# Altium schematic sheet Keng Seng - 3rd Step Down Circuit.SchDoc
size A4; SheetNumber: 1; SheetTotal: 1
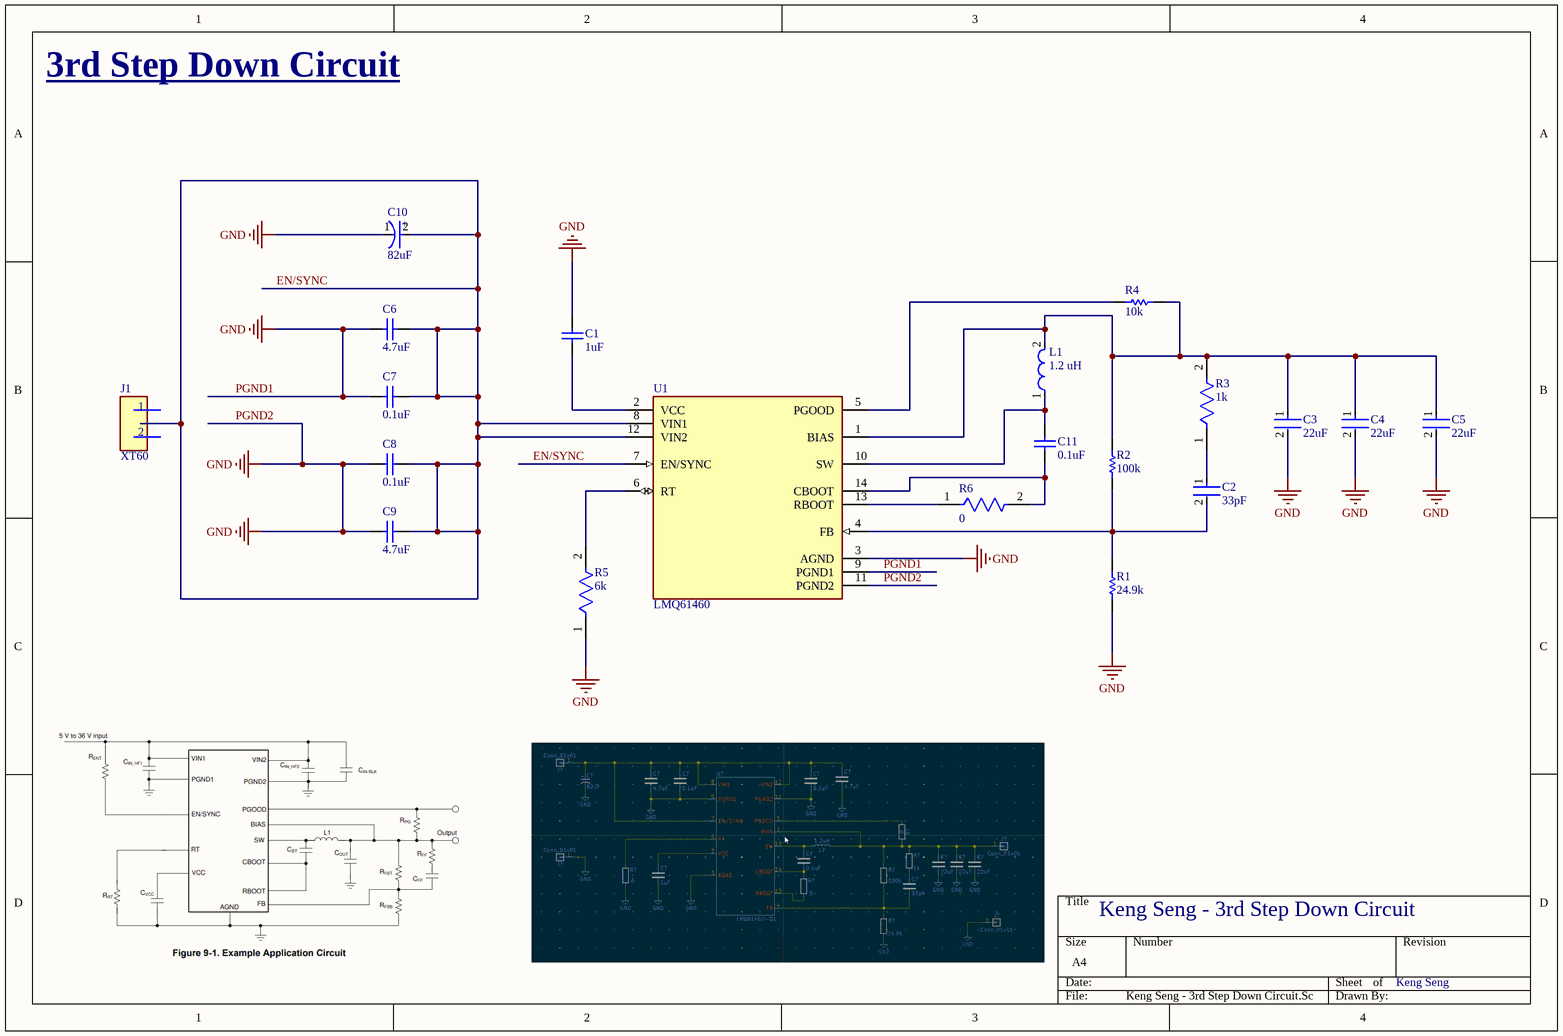
[diagram p0: Keng Seng - 3rd Step Down Circuit.SchDoc]

## Parts
C1  1uF  [CAPC2013X135X45LL10T25]
C2  33pF  [FP-CC0603-0_9-IPC_C]
C3  22uF  [FP-GRM21B-0_15-MFG]
C4  22uF  [FP-GRM21B-0_15-MFG]
C5  22uF  [FP-GRM21B-0_15-MFG]
C6  4.7uF  [CAPC2013X135X45LL10T25]
C7  0.1uF  [CAPC1005X55X30LL05T10]
C8  0.1uF  [CAPC1005X55X30LL05T10]
C9  4.7uF  [CAPC2013X135X45LL10T25]
C10  82uF  [FP-OS-CON-SMT-E12-MFG]
C11  0.1uF  [CAPC1005X55X30LL05T10]
J1  XT60  [FP-PRT-10474-MFG]
L1  1.2 uH  [FP-IHLP-5050FD-FP_2_945x4-MFG]
R1  24.9k  [RESC1609X55X30ML10T20]
R2  100k  [RESC0603X26X15LL03T05]
R3  1k  [FP-RC0402-0_4-IPC_A]
R4  10k  [RESC1609X50X30NL8T20]
R5  6k  [FP-RN732B-IPC_C]
R6  0  [FP-CRCW0402-e3-IPC_C]
U1  LMQ61460  [FP-RJR0014A-MFG]

## Nets
PGND1: C1.2 C3.2 C4.2 C5.2 C6.1 C7.1 C8.1 C9.1 C10.1(C) R1.1 R5.1 U1.3(AGND) U1.9(PGND1) U1.11(PGND2)  [also labelled GND, PGND2]
EN/SYNC: C6.2 C7.2 C8.2 C9.2 C10.2(A) U1.7(EN/SYNC) U1.8(VIN1) U1.12(VIN2)
NetC1_1: C1.1 U1.2(VCC)
NetC2_1: C2.1 R3.1
NetC2_2: C2.2 R1.2 R2.1 U1.4(FB)
NetC3_1: C3.1 C4.1 C5.1 L1.2 R2.2 R3.2 R4.2 U1.1(BIAS)
NetC11_1: C11.1 R6.2 U1.14(CBOOT)
NetC11_2: C11.2 L1.1 U1.10(SW)
NetR4_1: R4.1 U1.5(PGOOD)
NetR5_2: R5.2 U1.6(RT)
NetR6_1: R6.1 U1.13(RBOOT)

## Notes on the sheet
- 3rd Step Down Circuit
- Keng Seng - 3rd Step Down Circuit
- Keng Seng
- (in symbol CMP-05428-000027-2) +
- (in symbol CMP-157536-000001-1) 1; 2

## Library data of the parts
C1 = CMP-1036-04761-2: Manufacturer: Murata; Part Number: GRM21BR71H105KA12L
C2 = CMP-2000-06072-2: CAP CER 33PF 50V C0G/NPO 0603; Tolerance: 5%; Temperature Coefficient: 30ppm/°C; Dielectric: C0G; Insulation Resistance: 100GR; Dielectric Material: Ceramic; Voltage Rating (DC): 50V; Capacitance: 33pF; Voltage: 50V; Resistor Type: Ceramic; Lead Free: Lead Free; Mount: Surface Mount; Case Code (Imperial): 0603; Min Operating Temperature: -55°C; Package Quantity: 1; Case Code (Metric): 1608; Radiation Hardening: No; Packaging: Tape and Reel; Length: 1.6mm; Width: 0.031inch; Termination: SMD/SMT; Max Operating Temperature: 125°C; Series: CC; Case/Package: 0603; RoHS Compliant: Yes; Number of Pins: 2; REACH SVHC: No SVHC; Thickness: 0.035inch; Depth: 0.8mm; Voltage Rating: 50V; Height: 0.8mm
C3-C5 = CMP-2007-03385-2: Chip Multilayer Ceramic Capacitors for General Purpose, 0805, 22uF, X5R, 15%, 20%, 6.3V; Material: Ceramic; Max Operating Temperature: 85°C; Voltage: 6.3V; Min Operating Temperature: -55°C; Case/Package: 0805; Thickness: 0.053inch; Dielectric: X5R; Packaging: Tape and Reel; Depth: 1.25mm; Termination: SMD/SMT; Voltage Rating (DC): 6.3V; Radiation Hardening: No; Tolerance: 20%; Mount: Surface Mount; Lead Free: Lead Free; Package Quantity: 1; REACH SVHC: No SVHC; Voltage Rating: 6.3V; Capacitance: 22uF; Length: 2mm; Case Code (Imperial): 0805; Case Code (Metric): 2012; Width: 0.049inch; Height: 1.25mm
C6 C9 = CMP-1662-00015-2: Chip Capacitor, 4.7 uF, +/- 10%, 16 V, -55 to 85 degC, 0805 (2012 Metric), RoHS, Tape and Reel; PartNumber: GRM21BR61C475KA88L; Voltage Rating (DC): 16 V; Type (Capacitors): X5R; Case\/Package: 0805; Pins: 2; DatasheetVersion: 03/2016; REACH SVHC: No SVHC; Tolerance: 10%; Width: 1.25 mm; Capacitance: 4.7 uF; Mount: Surface Mount; ComponentLink1Description: Manufacturer URL; Case Code (Metric): 2012; PackageDescription: 2-Pin Surface Mount Device, Body 2 x 1.25 mm; Height: 1.25 mm; Voltage Rating: 16 V; Max Operating Temperature: 85 degC; RoHSCompliant: true; Length: 2 mm; ComponentLink1URL: http://www.murata.com/; Mounting Technology: Surface Mount; Packaging: Tape and Reel; Min Operating Temperature: -55 degC; ComponentLink2Description: Datasheet; Case Code (Imperial): 0805; Radiation Hardening: No; Package Quantity: 3000; PackageReference: 0805; ComponentLink2URL: http://search.murata.co.jp/Ceramy/image/img/A01X/G101/ENG/GRM21BR61C475KA88-01.pdf
C7 C8 C11 = CMP-0001-00074-2: Manufacturer: Kemet; Part Number: C0402C104K4RACTU
C10 = CMP-05428-000027-2: Conductive Polymer Aluminum Solid Capacitors (OS-CON) 82uF ±20% 35V; Ripple Current (AC): 4A; Dissipation Factor: 12%; ESR (Equivalent Series Resistance): 20mR; Polarity: Polar; Life (Hours): 5000Hour; Leakage Current: 574uA; Lead Free: Lead Free; Number of Pins: 12; Ripple Current: 4A; Capacitance: 82uF; Series: OS-CON™, SVPF; Height: 11.9mm; Min Operating Temperature: -55°C; Tolerance: 20%; Voltage Rating: 35V; Voltage Rating (DC): 35V; Case/Package: Radial; Diameter: 8mm; Voltage: 35V; Construction: Cylindrical; Packaging: Tape and Reel; Mount: Surface Mount; REACH SVHC: No SVHC; Height - Seated (Max): 0.472inch; Max Operating Temperature: 105°C; Package Quantity: 400; Termination: SMD/SMT; RoHS Compliant: Yes; Length: 11.9mm
J1 = CMP-157536-000001-1: XT60 CONNECTORS MALE/FEMALE PAIR
L1 = CMP-02424-000367-1: Commercial Inductors, High Saturation Series 1.2uH 30A 2.5mΩ 20%; Max DC Current: 48A; Shielding: Shielded; Test Frequency: 100kHz; DC Resistance (DCR): 2.5mR; Core Material: Metal; Self Resonant Frequency: 5MHz; Lead Free: Lead Free; Radiation Hardening: No; Case/Package: 5050; Termination: SMD/SMT; Package Quantity: 250; Packaging: Tape and Reel; Width: 0.508inch; Saturation Current: 48A; Number of Pins: 5050; Inductance Tolerance: 20%; Height - Seated (Max): 0.256inch; RMS Current (Irms): 30A; Tolerance: 20%; Military Standard: Not; Inductance: 1.2uH; Max Operating Temperature: 125°C; Min Operating Temperature: -55°C; Mount: Surface Mount; Depth: 12.9mm; Current Rating: 30A; Contact Plating: Tin; Length: 13.7mm; Height: 6.5mm
R1 = CMP-2000-03742-1: Part Number: TNPW060324R9BEEA; Manufacturer: Vishay Dale
R2 = CMP-2004-02449-1: Part Number: MCCN-41JL6--100K; Manufacturer: Multicomp
R3 = CMP-2002-07472-3: RES 1K OHM 1% 1/16W 0402; Max Power Dissipation: 63mW; Resistance: 1kR; Voltage Rating (DC): 50V; Temperature Coefficient: 100ppm/°C; Power Rating: 62.5mW; Technology: THICK FILM; Size Code: 0402; Series: RC; Length: 1mm; Case/Package: 0402; Features: Moisture Resistant; Termination: SMD/SMT; Case Code (Metric): 1005; Reach SVHC Compliant: Yes; Number of Terminations: 2; Tolerance: 1%; Lead Free: Lead Free; Military Standard: Not; Resistor Type: Thick Film; Max Operating Temperature: 155°C; RoHS Compliant: Yes; Construction: Rectangular; Voltage Rating: 50V; Packaging: Tape and Reel; Height: 0.32mm; Number of Pins: 2; Resistance Tolerance: 1%; Case Code (Imperial): 0402; Depth: 0.5mm; Min Operating Temperature: -55°C; Width: 0.5mm
R4 = CMP-1666-00005-4: Chip Resistor, 10 KOhm, +/- 1%, 100 mW, -55 to 155 degC, 0603 (1608 Metric), RoHS, Tape and Reel; Manufacturer: Vishay Semiconductor; Voltage Rating: 75 V; Max Operating Temperature: 155 degC; PackageDescription: 2-Pin Surface Mount Device, Body 1.575 x 0.85 mm; ComponentLink1Description: Manufacturer URL; RoHSCompliant: true; PackageReference: 0603; REACH SVHC: Unknown; Length: 1.55 mm; DatasheetVersion: 06/2012; Packaging: Tape and Reel; Min Operating Temperature: -55 degC; Mounting Technology: Surface Mount; ComponentLink2URL: https://datasheet.ciiva.com/11809/0900766b80d98afc-11809037.pdf; Height: 0.45 mm; ComponentLink2Description: Datasheet; Package Quantity: 5000; ComponentLink1URL: http://www.vishay.com/
R5 = CMP-04015-069444-1: 6kΩ ±0.1% 0.125W, 1/8W Chip Resistor 1206 (3216 Metric) Moisture Resistant Thin Film; Resistance: 6kR; Voltage Rating: 150V; Temperature Coefficient: 25ppm/°C; Power Rating: 125mW; Max Operating Temperature: 125°C; Composition: Thin Film; Width: 1.6mm; Termination: SMD/SMT; Packaging: Tape and Reel; Case Code (Metric): 3216; Weight: 0.000571oz; Length: 3.2mm; Min Operating Temperature: -55°C; Tolerance: 0.1%; Case Code (Imperial): 1206; Height: 0.6mm; Case/Package: 1206
R6 = CMP-2002-08122-2: RES Thick Film, 0Ω, 0.063W, 0402; Tolerance: 5%; Max Power Dissipation: 63mW; Voltage Rating: 50V; Temperature Coefficient: 100ppm/°C; Resistance: 0mR; Contact Plating: Tin; Height: 0.35mm; Radiation Hardening: No; Features: Automotive AEC-Q200; Composition: Thick Film; Width: 0.5mm; Weight: 2.3E-05oz; Termination: SMD/SMT; Packaging: Tape and Reel; Mount: Surface Mount; Case Code (Metric): 1005; Military Standard: Not; Min Operating Temperature: -55°C; Number of Terminations: 2; Package Quantity: 1; Case Code (Imperial): 0402; Depth: 0.5mm; Max Operating Temperature: 155°C; Case/Package: 0402; Power Rating: 63mW; Lead Free: Lead Free; Voltage Rating (DC): 50V; Length: 1mm
U1 = CMP-04918-000596-1: AUTOMOTIVE 3-V TO 36-V, 6-A LOW